# EAGLE design dragonjoy (EAGLE 7.3.0)
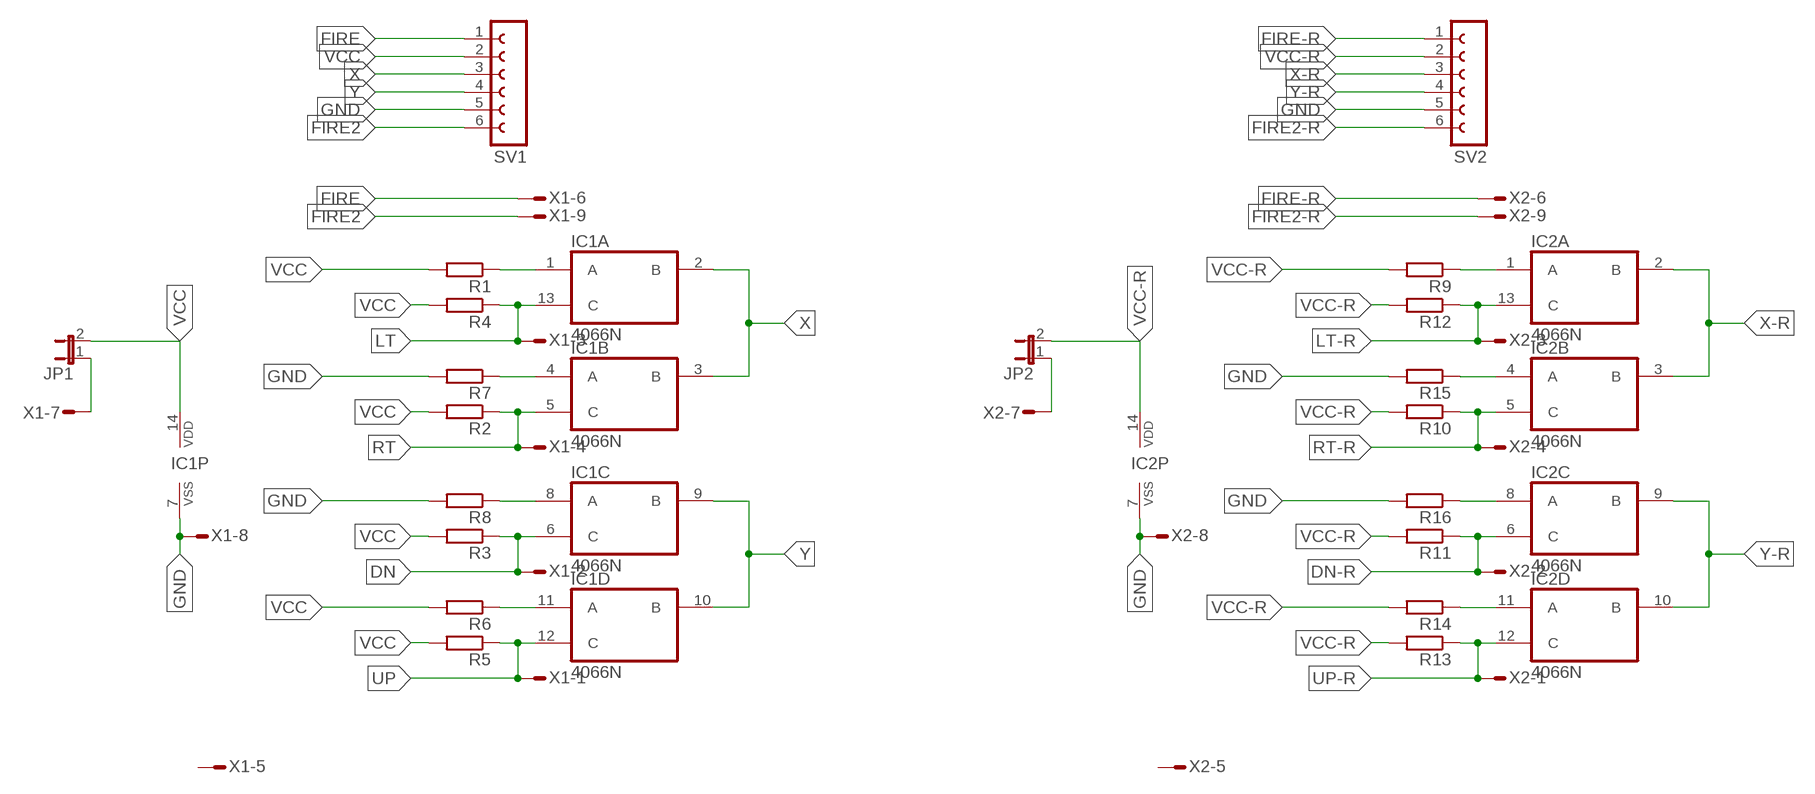
[diagram p0: schematic, sheet 1]

## Parts
IC1  4066N  [DIL14]
IC2  4066N  [DIL14]
JP1  JP1E  [JP1]
JP2  JP1E  [JP1]
R1  R-EU_0207/10  [0207/10]
R2  R-EU_0207/10  [0207/10]
R3  R-EU_0207/10  [0207/10]
R4  R-EU_0207/10  [0207/10]
R5  R-EU_0207/10  [0207/10]
R6  R-EU_0207/10  [0207/10]
R7  R-EU_0207/10  [0207/10]
R8  R-EU_0207/10  [0207/10]
R9  R-EU_0207/10  [0207/10]
R10  R-EU_0207/10  [0207/10]
R11  R-EU_0207/10  [0207/10]
R12  R-EU_0207/10  [0207/10]
R13  R-EU_0207/10  [0207/10]
R14  R-EU_0207/10  [0207/10]
R15  R-EU_0207/10  [0207/10]
R16  R-EU_0207/10  [0207/10]
SV1  FE06-1  [FE06]
SV2  FE06-1  [FE06]
X1  M09-182S  [182-009-MALE]
X2  M09-182S  [182-009-MALE]

## Nets
DN: IC1.6(C:C) R3.1 X1.2
DN-R: IC2.6(C:C) R11.1 X2.2
FIRE: SV1.1 X1.6
FIRE2: SV1.6 X1.9
FIRE2-R: SV2.6 X2.9
FIRE-R: SV2.1 X2.6
GND: IC1.7(P:VSS) IC2.7(P:VSS) R7.2 R8.2 R15.2 R16.2 SV1.5 SV2.5 X1.8 X2.8
LT: IC1.13(A:C) R4.1 X1.3
LT-R: IC2.13(A:C) R12.1 X2.3
N$1: JP1.1 X1.7
N$2: IC2.1(A:A) R9.1
N$3: IC1.1(A:A) R1.1
N$4: IC2.11(D:A) R14.1
N$5: IC2.4(B:A) R15.1
N$6: IC2.8(C:A) R16.1
N$7-R: JP2.1 X2.7
N$8: IC1.11(D:A) R6.1
N$9: IC1.4(B:A) R7.1
N$10: IC1.8(C:A) R8.1
RT: IC1.5(B:C) R2.1 X1.4
RT-R: IC2.5(B:C) R10.1 X2.4
UP: IC1.12(D:C) R5.1 X1.1
UP-R: IC2.12(D:C) R13.1 X2.1
VCC: IC1.14(P:VDD) JP1.2 R1.2 R2.2 R3.2 R4.2 R5.2 R6.2 SV1.2
VCC-R: IC2.14(P:VDD) JP2.2 R9.2 R10.2 R11.2 R12.2 R13.2 R14.2 SV2.2
X: IC1.2(A:B) IC1.3(B:B) SV1.3
X-R: IC2.2(A:B) IC2.3(B:B) SV2.3
Y: IC1.9(C:B) IC1.10(D:B) SV1.4
Y-R: IC2.9(C:B) IC2.10(D:B) SV2.4
Unconnected: X1.5 X2.5

## Library data of the parts
IC1 IC2 = 40xx:4066: Quad bilateral ANALOG SWITCH
JP1 JP2 = jumper:JP1E: JUMPER
R1-R16 = rcl:R-EU_: RESISTOR, European symbol
SV1 SV2 = con-lsta:FE06-1: FEMALE HEADER; OC_FARNELL: unknown; OC_NEWARK: unknown
X1 X2 = con-subd:M09?S: SUB-D; OC_FARNELL: unknown; OC_NEWARK: unknown

## Board
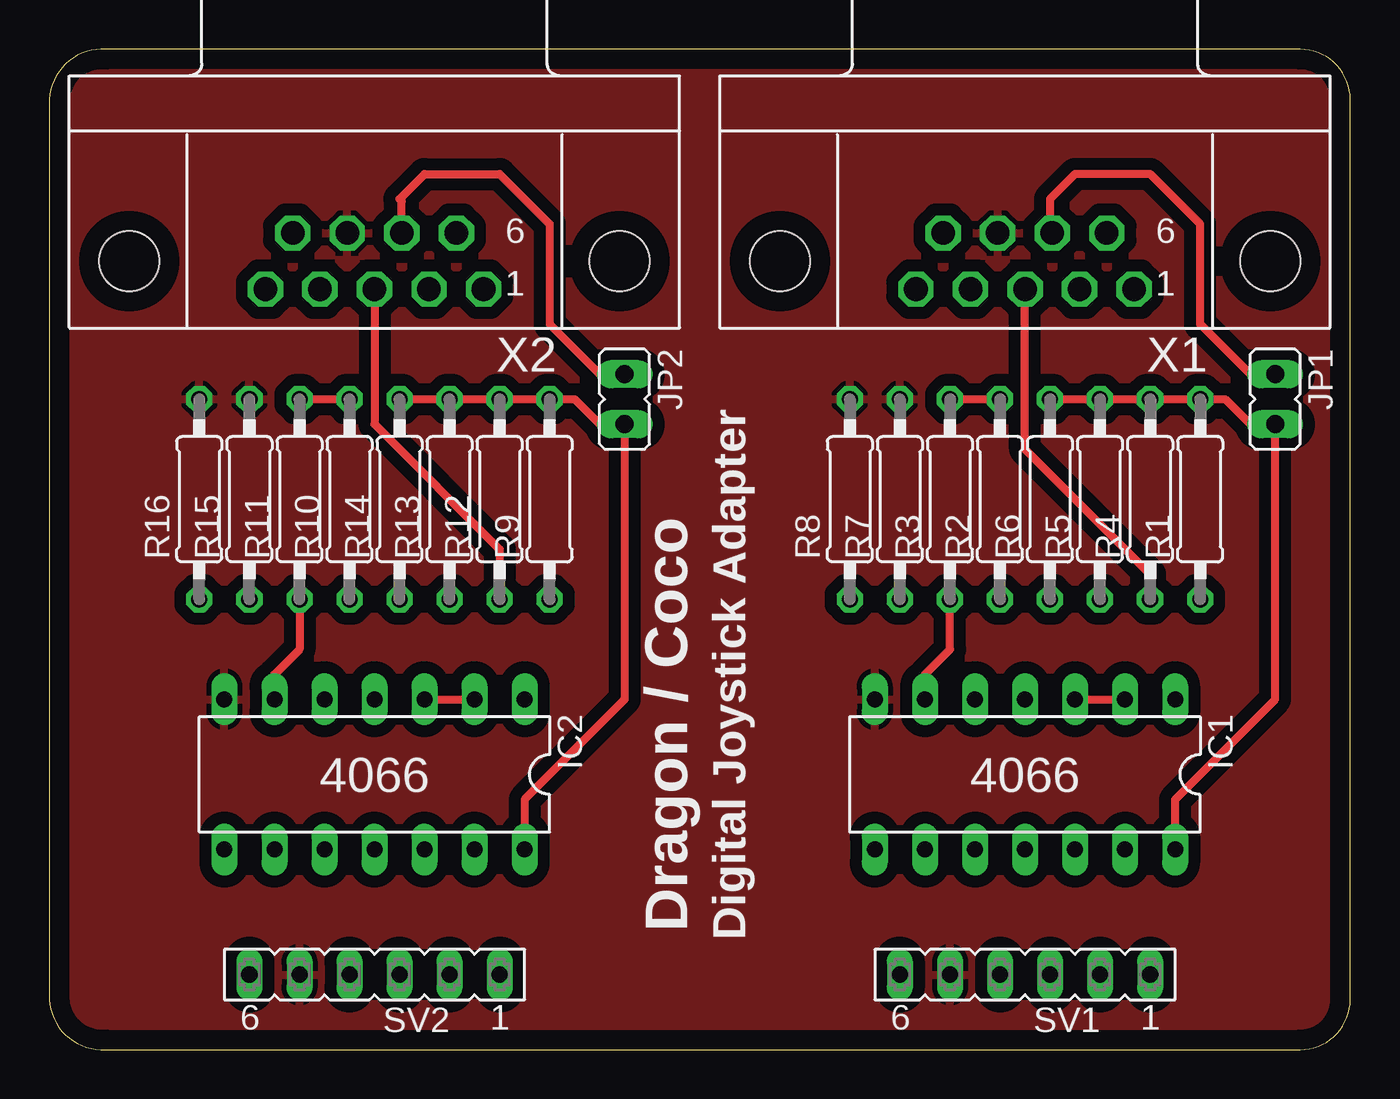
[diagram p1: board, top side]
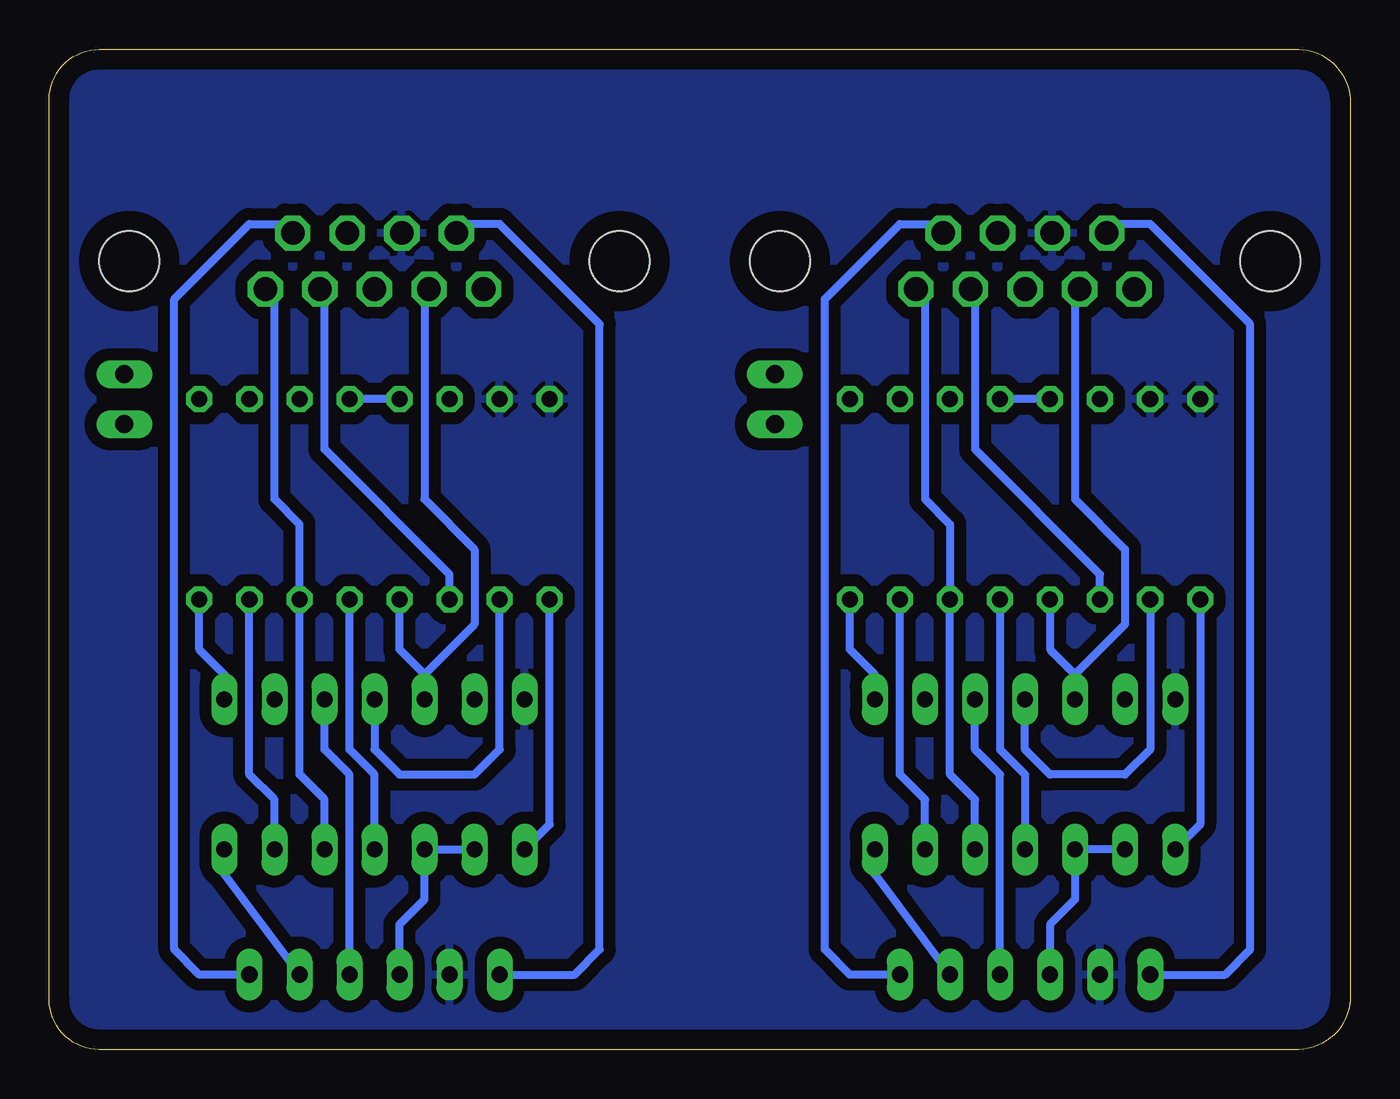
[diagram p2: board, bottom side, seen from below]

Size 66.04 x 50.79 mm. Coordinates in mm from the lower left corner, seen from the top.
Outline: 2.87,0 63.5,0 arc90 66.04,2.54 66.04,48.24 arc90 63.5,50.78 2.87,50.78 arc90 0,48.26 0,2.54 arc90 2.87,0
Copper layers (1*16): Top 0.035mm / dielectric 1.5mm / Bottom 0.035mm
Design rules "default": minimum track width 10mil, minimum drill 24mil, track to track 8mil, track to pad 8mil, pad to pad 8mil, via to via 8mil, smd to smd 8mil, copper to edge 40mil, drill to drill 8mil, minimum pad ring 10mil, minimum via ring 8mil, stop-mask expansion 4mil, vias tented up to drill 0mil, thermal gap 10mil

### Footprints (pad centres in the part's own frame; a part is rotated, then mirrored left to right if it is on the bottom)
DIL14 = drill 0.813 long: 1 -7.62,-3.81; 2 -5.08,-3.81; 3 -2.54,-3.81; 4 0,-3.81; 5 2.54,-3.81; 6 5.08,-3.81; 7 7.62,-3.81; 8 7.62,3.81; 9 5.08,3.81; 10 2.54,3.81; 11 0,3.81; 12 -2.54,3.81; 13 -5.08,3.81; 14 -7.62,3.81
JP1 = drill 0.914 long: 1 0,-1.27; 2 0,1.27
0207/10 = drill 0.813 octagon: 1 -5.08,0; 2 5.08,0
FE06 = drill 0.813 long: 1 -6.35,0; 2 -3.81,0; 3 -1.27,0; 4 1.27,0; 5 3.81,0; 6 6.35,0
182-009-MALE = drill 1.194 pad 1.524 octagon: 1 -5.537,10.923; 2 -2.769,10.923; 3 0,10.923; 4 2.769,10.923; 5 5.537,10.923; 6 -4.153,8.08; 7 -1.384,8.08; 8 1.384,8.08; 9 4.153,8.08 | hole 3.048: -12.446,9.501; 12.446,9.501

### Placement (x,y rotation side)
IC1  49.53,13.97 180 top
IC2  16.51,13.97 180 top
JP1  62.23,33.02 180 top
JP2  29.21,33.02 180 top
R1  58.42,27.94 90 top
R2  48.26,27.94 90 top
R3  45.72,27.94 90 top
R4  55.88,27.94 90 top
R5  53.34,27.94 90 top
R6  50.8,27.94 90 top
R7  43.18,27.94 90 top
R8  40.64,27.94 90 top
R9  25.4,27.94 90 top
R10  15.24,27.94 90 top
R11  12.7,27.94 90 top
R12  22.86,27.94 90 top
R13  20.32,27.94 90 top
R14  17.78,27.94 90 top
R15  10.16,27.94 90 top
R16  7.62,27.94 90 top
SV1  49.53,3.81 180 top
SV2  16.51,3.81 180 top
X1  49.53,49.53 180 top
X2  16.51,49.53 180 top

### Tracks (layer width: path | path; a pad name or v marks a point on that pad's centre or on a via)
DN
  Top 0.406: IC1.6 44.45,19.05 45.72,20.32 R3.1
  Bottom 0.406: R3.1 45.72,24.13 52.07,30.48 52.07,38.38 X1.2
DN-R
  Top 0.406: R11.1 12.7,20.32 11.43,19.05 IC2.6
  Bottom 0.406: X2.2 19.28,38.33 19.05,38.1 19.05,30.48 12.7,24.13 R11.1
FIRE
  Bottom 0.406: SV1.1 58.42,3.81 59.69,5.08 59.69,38.1 55.88,41.91 54.14,41.91 X1.6
FIRE2
  Bottom 0.406: SV1.6 39.37,3.81 38.1,5.08 38.1,36.83 43.18,41.91 44.92,41.91 X1.9
FIRE2-R
  Bottom 0.406: SV2.6 6.35,3.81 5.08,5.08 5.08,36.83 10.16,41.91 11.9,41.91 X2.9
FIRE-R
  Bottom 0.406: SV2.1 25.4,3.81 26.67,5.08 26.67,38.1 22.86,41.91 21.12,41.91 X2.6
GND
  pour Bottom (isolate 0.61): 66.04,48.26 66.04,2.54 arc-90 63.5,0 2.54,0 arc-90 0,2.54 0,48.26 arc-90 2.54,50.8 63.5,50.8 arc-90
  pour Top (isolate 0.61): 66.04,48.26 66.04,2.54 arc-90 63.5,0 2.54,0 arc-90 0,2.54 0,48.26 arc-90 2.54,50.8 63.5,50.8 arc-90
LT
  Top 0.406: R4.1 55.88,24.13 49.53,30.48 X1.3
  Bottom 0.406: IC1.13 54.61,12.7 55.88,13.97 R4.1
LT-R
  Top 0.406: X2.3 16.51,31.75 22.86,25.4 R12.1
  Bottom 0.406: IC2.13 21.59,12.7 22.86,13.97 R12.1
N$1
  Top 0.406: JP1.1 60.96,34.29 58.42,36.83 58.42,41.91 55.88,44.45 52.07,44.45 50.8,43.18 50.8,41.57 X1.7
N$2
  Bottom 0.406: IC2.1 24.13,19.05 25.4,20.32 R9.1
N$3
  Bottom 0.406: IC1.1 57.15,19.05 58.42,20.32 R1.1
N$4
  Bottom 0.406: R14.1 17.78,15.24 16.51,13.97 IC2.11
N$5
  Bottom 0.406: R15.1 10.16,15.24 11.43,13.97 15.24,13.97 16.51,15.24 IC2.4
N$6
  Bottom 0.406: R16.1 7.62,11.43 IC2.8
N$7-R
  Top 0.406: X2.7 17.89,43.07 17.78,43.18 19.05,44.45 22.86,44.45 25.4,41.91 25.4,36.83 27.94,34.29 JP2.1
N$8
  Bottom 0.406: IC1.11 49.53,13.97 50.8,15.24 R6.1
N$9
  Bottom 0.406: IC1.4 49.53,15.24 48.26,13.97 44.45,13.97 43.18,15.24 R7.1
N$10
  Bottom 0.406: IC1.8 40.64,11.43 R8.1
RT
  Bottom 0.406: IC1.5 46.99,19.05 | 46.99,19.05 48.26,20.32 R2.1 | X1.4 46.76,38.33 46.99,38.1 46.99,27.94 44.45,25.4 44.45,21.59 46.99,19.05
RT-R
  Bottom 0.406: X2.4 13.74,38.33 13.97,38.1 13.97,27.94 11.43,25.4 11.43,21.59 13.97,19.05 | R10.1 15.24,20.32 13.97,19.05 | 13.97,19.05 IC2.5
UP
  Bottom 0.406: IC1.12 52.07,12.7 53.34,13.97 R5.1 53.34,26.67 54.61,27.94 54.61,38.15 X1.1
UP-R
  Bottom 0.406: X2.1 22.05,38.56 21.59,38.1 21.59,27.94 20.32,26.67 R13.1 20.32,13.97 19.05,12.7 IC2.12
VCC
  Top 0.406: R3.2 R2.2 | R6.2 R5.2 R4.2 R1.2 59.69,33.02 60.96,31.75 JP1.2 62.23,17.78 57.15,12.7 IC1.14
  Bottom 0.406: R2.2 R6.2 | SV1.2 57.15,8.89 IC1.14
VCC-R
  Top 0.406: R11.2 R10.2 | R14.2 R13.2 R12.2 R9.2 26.67,33.02 27.94,31.75 JP2.2 29.21,17.78 24.13,12.7 IC2.14
  Bottom 0.406: R10.2 R14.2 | SV2.2 24.13,8.89 IC2.14
X
  Top 0.406: IC1.3 IC1.2
  Bottom 0.406: SV1.3 50.8,13.97 52.07,15.24 IC1.3
X-R
  Top 0.406: IC2.3 IC2.2
  Bottom 0.406: SV2.3 17.78,13.97 19.05,15.24 IC2.3
Y
  Bottom 0.406: IC1.9 IC1.10 46.99,7.62 48.26,6.35 SV1.4
Y-R
  Bottom 0.406: IC2.9 IC2.10 13.97,7.62 15.24,6.35 SV2.4

### Text on the board
tPlace: Digital Joystick Adapter | Dragon / Coco | 4066 | 4066